# EAGLE schematic upper_final (EAGLE 7.1.0)
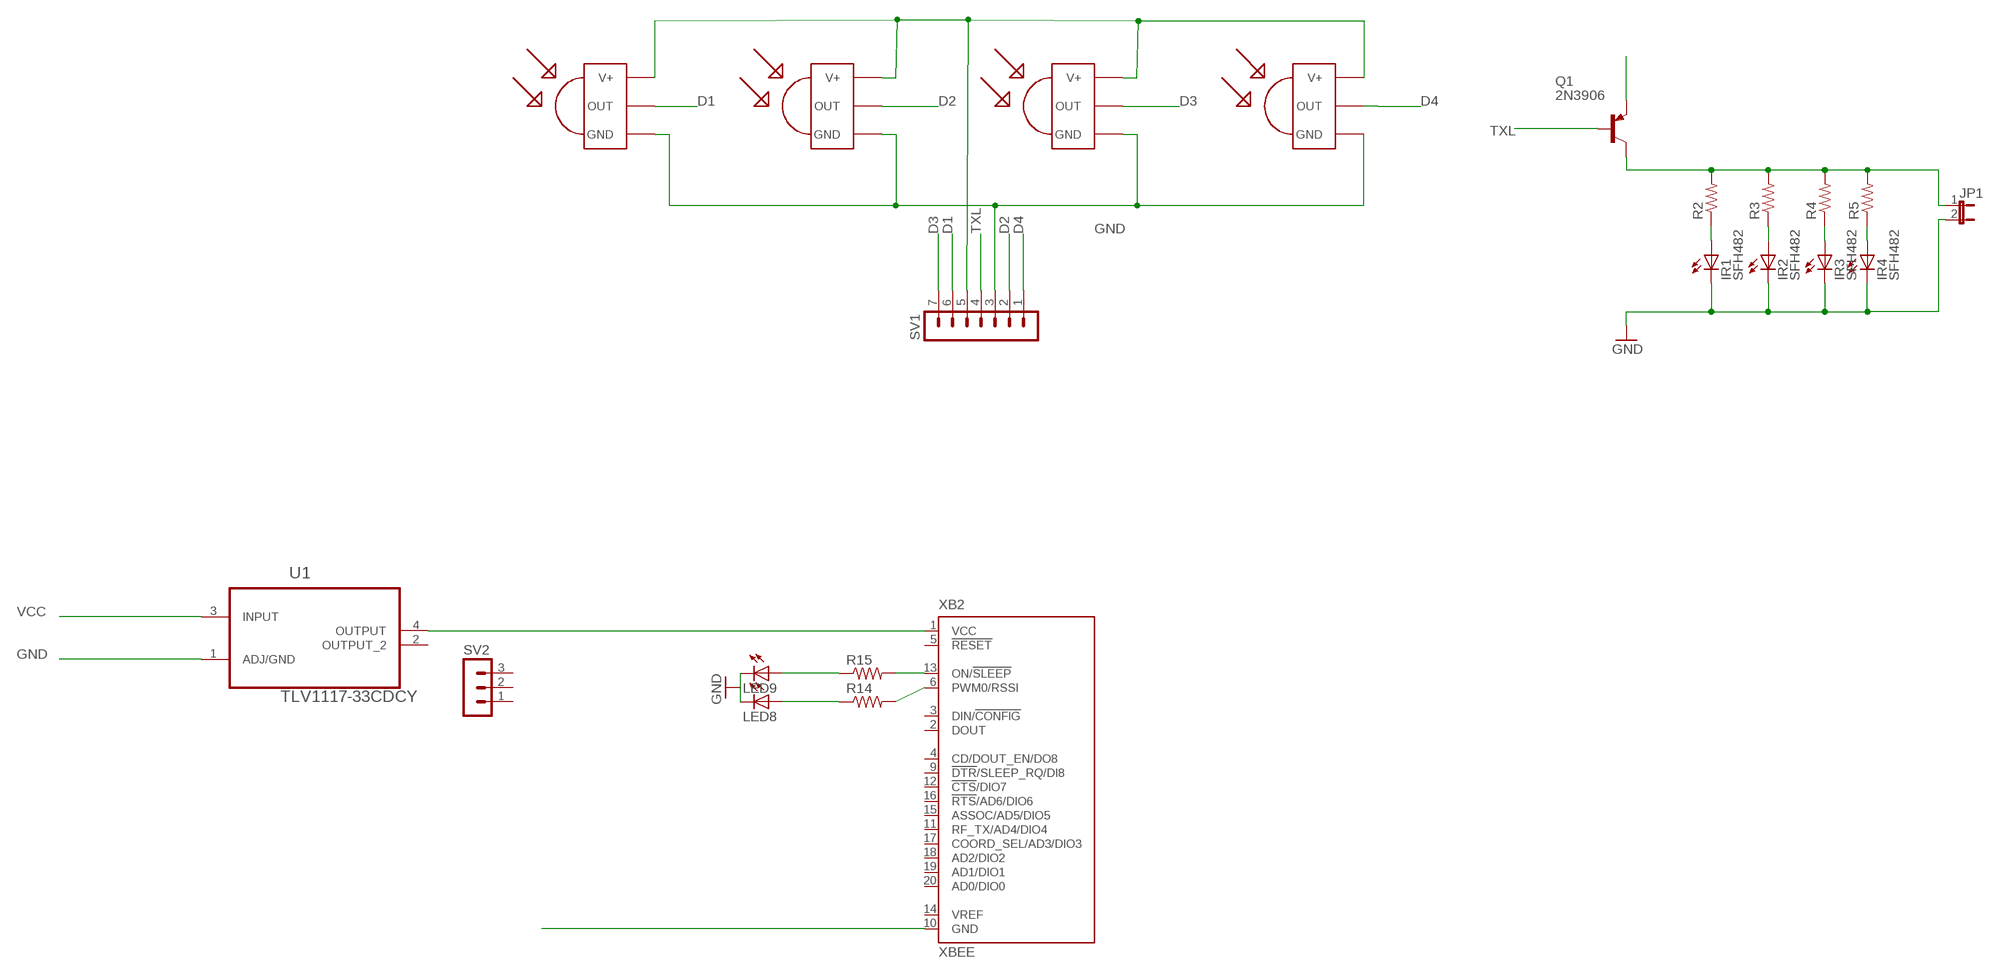
[diagram p0: schematic, sheet 1]

## Parts
IR1  SFH482  [SFH482]
IR2  SFH482  [SFH482]
IR3  SFH482  [SFH482]
IR4  SFH482  [SFH482]
JP1  JP1E  [JP1]
LED8  LED3MM  [LED3MM]
LED9  LED3MM  [LED3MM]
Q1  2N3906  [TO92]
R2  R-US_0204/7  [0204/7]
R3  R-US_0204/7  [0204/7]
R4  R-US_0204/7  [0204/7]
R5  R-US_0204/7  [0204/7]
R14  R-US_0207/10  [0207/10]
R15  R-US_0207/10  [0207/10]
SV1  MA07-1  [MA07-1]
SV2  MA03-1  [MA03-1]
U1  TLV1117-33CDCY  [SOT230P700X180-4N]
U$1  TSOP1738  [TSOP17XX]
U$2  TSOP1738  [TSOP17XX]
U$3  TSOP1738  [TSOP17XX]
U$4  TSOP1738  [TSOP17XX]
XB2  XBEE  [XBEE]

## Nets
D1: SV1.6 U$1.OUT
D2: SV1.2 U$2.OUT
D3: SV1.7 U$3.OUT
D4: SV1.1 U$4.OUT
GND: IR1.K(C) IR2.K(C) IR3.K(C) IR4.K(C) JP1.2 LED8.K(C) LED9.K(C) SV1.3 U1.1(ADJ/GND) U$1.GND U$2.GND U$3.GND U$4.GND XB2.10(GND)
N$3: IR1.A R2.1
N$4: IR2.A R3.1
N$5: IR3.A R4.1
N$6: IR4.A R5.1
N$7: JP1.1 Q1.1(C) R2.2 R3.2 R4.2 R5.2
N$19: R15.2 XB2.13(ON/!SLEEP)
N$29: U1.4(OUTPUT) XB2.1(VCC)
N$31: LED8.A R14.1
N$32: LED9.A R15.1
N$33: R14.2 XB2.6(PWM0/RSSI)
TXL: Q1.2(B) SV1.4
VCC: Q1.3(E) SV1.5 U1.3(INPUT) U$1.V+ U$2.V+ U$3.V+ U$4.V+
Unconnected: SV2.1 SV2.2 SV2.3 U1.2(OUTPUT_2) XB2.2(DOUT) XB2.3(DIN/!CONFIG) XB2.4(CD/DOUT_EN/DO8) XB2.5(!RESET) XB2.9(!DTR!/SLEEP_RQ/DI8) XB2.11(RF_TX/AD4/DIO4) XB2.12(!CTS!/DIO7) XB2.14(VREF) XB2.15(ASSOC/AD5/DIO5) XB2.16(!RTS!/AD6/DIO6) XB2.17(COORD_SEL/AD3/DIO3) XB2.18(AD2/DIO2) XB2.19(AD1/DIO1) XB2.20(AD0/DIO0)

## Library data of the parts
IR1-IR4 = led:SFH482: IR LED infrared emitting diode, Infineon
JP1 = jumper:JP1E: JUMPER
LED8 LED9 = led:LED: LED OSRAM: - CHIPLED LG R971, LG N971, LY N971, LG Q971, LY Q971, LO R971, LY R971 LH N974, LH R974 LS Q976, LO Q976, LY Q976 LO Q996 - Hyper CHIPLED LW Q18S LB Q993, LB Q99A, LB R99A - SideLED LS A670, LO A670, LY A670, LG A670, LP A670 LB A673, LV A673, LT A673, LW A673 LH A674 LY A675 LS A676, LA A676, LO A676, LY A676, LW A676 LS A679, LY A679, LG A679 - Hyper Micro SIDELED® LS Y876, LA Y876, LO Y876, LY Y876 LT Y87S - SmartLED LW L88C, LW L88S LB L89C, LB L89S, LG L890 LS L89K, LO L89K, LY L89K LS L896, LA L896, LO L896, LY L896 - TOPLED LS T670, LO T670, LY T670, LG T670, LP T670 LSG T670, LSP T670, LSY T670, LOP T670, LYG T670 LG T671, LOG T671, LSG T671 LB T673, LV T673, LT T673, LW T673 LH T674 LS T676, LA T676, LO T676, LY T676, LB T676, LH T676, LSB T676, LW T676 LB T67C, LV T67C, LT T67C, LS T67K, LO T67K, LY T67K, LW E67C LS E67B, LA E67B, LO E67B, LY E67B, LB E67C, LV E67C, LT E67C LW T67C LS T679, LY T679, LG T679 LS T770, LO T770, LY T770, LG T770, LP T770 LB T773, LV T773, LT T773, LW T773 LH T774 LS E675, LA E675, LY E675, LS T675 LS T776, LA T776, LO T776, LY T776, LB T776 LHGB T686 LT T68C, LB T68C - Hyper Mini TOPLED® LB M676 - Mini TOPLED Santana® LG M470 LS M47K, LO M47K, LY M47K Source: http://www.osram.convergy.de LUXEON: - LUMILED® LXK2-PW12-R00, LXK2-PW12-S00, LXK2-PW14-U00, LXK2-PW14-V00 LXK2-PM12-R00, LXK2-PM12-S00, LXK2-PM14-U00 LXK2-PE12-Q00, LXK2-PE12-R00, LXK2-PE12-S00, LXK2-PE14-T00, LXK2-PE14-U00 LXK2-PB12-K00, LXK2-PB12-L00, LXK2-PB12-M00, LXK2-PB14-N00, LXK2-PB14-P00, LXK2-PB14-Q00 LXK2-PR12-L00, LXK2-PR12-M00, LXK2-PR14-Q00, LXK2-PR14-R00 LXK2-PD12-Q00, LXK2-PD12-R00, LXK2-PD12-S00 LXK2-PH12-R00, LXK2-PH12-S00 LXK2-PL12-P00, LXK2-PL12-Q00, LXK2-PL12-R00 Source: www.luxeon.com KINGBRIGHT: KA-3528ASYC Source: www.kingbright.com
Q1 = transistor-pnp:2N3906: PNP Transistor
R2-R5 = resistor:R-US_: RESISTOR, American symbol
R14 R15 = rcl:R-US_: RESISTOR, American symbol
SV1 = con-lstb:MA07-1: PIN HEADER; OC_FARNELL: unknown; OC_NEWARK: unknown
SV2 = con-lstb:MA03-1: PIN HEADER; OC_FARNELL: unknown; OC_NEWARK: unknown
U1 = Texas Instruments_By_element14_Batch_1:TLV1117-33CDCY: V REG, LDO, 3.3V, 0.8A; MPN: TLV1117-33CDCY; OC_FARNELL: 1494942; OC_NEWARK: 67K8520; PACKAGE: SOT-223-3; SUPPLIER: TEXAS INSTRUMENTS
U$1-U$4 = tsop:TSOP1738: IR Receiver and Demodulator
XB2 = maxstream:XBEE: XBee (TM) /XBee-PRO(TM) OEM RF Modules Source: MaxStream, Inc. xbee_productmanual.pdf; MPN: XBP24-Z7UIT-004; OC_FARNELL: 1751799; OC_NEWARK: 34R5507